# EAGLE schematic Servo-Steuer-Schaltung (EAGLE 6.2)
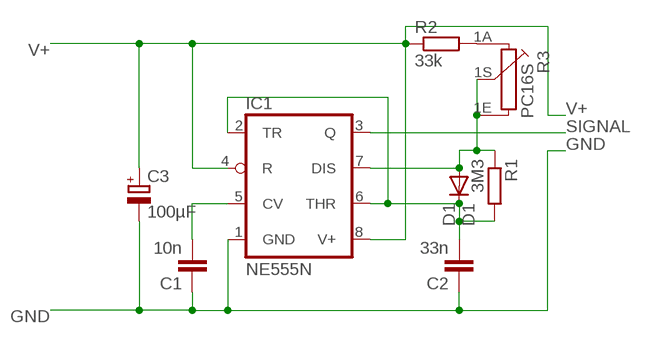
[diagram p0: schematic, sheet 1]

## Parts
C1  10n  C10/4  [C10B4]
C2  33n  C10/4  [C10B4]
C3  100µF  CPOL-EUE2.5-7  [E2,5-7]
D1  D1  1N4148DO35-7  [DO35-7]
IC1  NE555N  [DIL08]
R1  3M3  R-EU_0207/10  [0207/10]
R2  33k  R-EU_0207/10  [0207/10]
R3  PC16S  [PC16S]

## Nets
GND: C1.1 C2.1 C3.- IC1.1(GND)
N$2: R2.2 R3.1A
N$3: D1.A IC1.7(DIS) R1.1 R3.1E R3.1S
N$4: C2.2 D1.C IC1.2(TR) IC1.6(THR) R1.2
N$7: C1.2 IC1.5(CV)
SIGNAL: IC1.3(Q)
V+: C3.+ IC1.4(R) IC1.8(V+) R2.1

## Library data of the parts
C1 C2 = capacitor-wima:C: CAPACITOR naming: grid - package width
C3 = rcl:CPOL-EU: POLARIZED CAPACITOR, European symbol
D1 = diode:1N4148: DIODE high speed (Philips)
IC1 = linear:*555: TIMER
R1 R2 = rcl:R-EU_: RESISTOR, European symbol
R3 = piher:PC16S: POTENTIOMETER single carbon potentiometer, 16 mm, S3ROH; OC_FARNELL: 4452940; OC_NEWARK: unknown